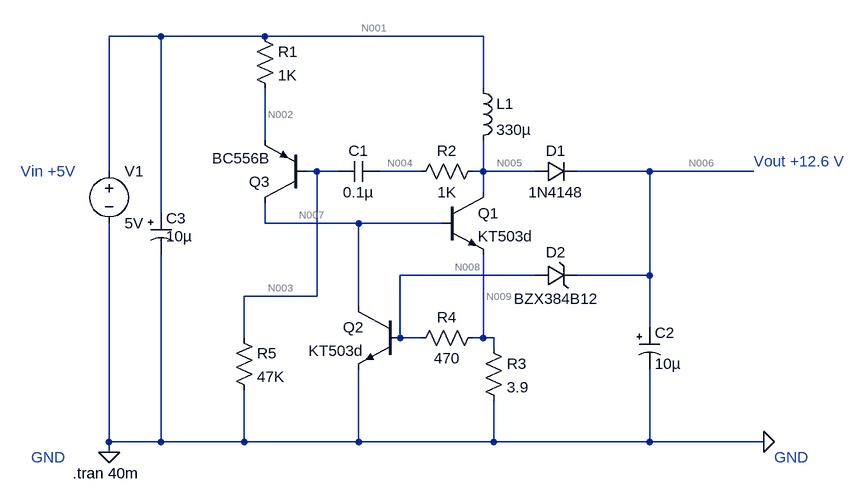
[diagram p0: schematic курсач.asc]
курсач.asc, the LTspice schematic file:
Version 4
SHEET 1 1116 704
WIRE 48 16 -32 16
WIRE 208 16 48 16
WIRE 544 16 208 16
WIRE 544 96 544 16
WIRE 208 176 208 96
WIRE -32 224 -32 16
WIRE 288 224 272 224
WIRE 320 224 288 224
WIRE 448 224 384 224
WIRE 544 224 544 176
WIRE 544 224 528 224
WIRE 624 224 544 224
WIRE 800 224 688 224
WIRE 960 224 800 224
WIRE 544 256 544 224
WIRE 48 288 48 16
WIRE 208 304 208 272
WIRE 352 304 208 304
WIRE 480 304 352 304
WIRE 624 384 416 384
WIRE 800 384 800 224
WIRE 800 384 688 384
WIRE 288 416 288 224
WIRE 288 416 176 416
WIRE 352 432 352 304
WIRE 800 464 800 384
WIRE 176 480 176 416
WIRE 416 480 416 384
WIRE 448 480 416 480
WIRE 544 480 544 352
WIRE 544 480 528 480
WIRE 560 480 544 480
WIRE 560 496 560 480
WIRE -32 640 -32 304
WIRE 48 640 48 352
WIRE 48 640 -32 640
WIRE 176 640 176 560
WIRE 176 640 48 640
WIRE 352 640 352 528
WIRE 352 640 176 640
WIRE 560 640 560 576
WIRE 560 640 352 640
WIRE 800 640 800 528
WIRE 800 640 560 640
WIRE 976 640 800 640
WIRE -32 656 -32 640
FLAG 976 640 0
FLAG -32 656 0
SYMBOL res 192 0 R0
SYMATTR InstName R1
SYMATTR Value 1K
SYMATTR SpiceLine tol=1 pwr=0.1
SYMBOL cap 384 208 R90
WINDOW 0 0 32 VBottom 2
WINDOW 3 32 32 VTop 2
SYMATTR InstName C1
SYMATTR Value 0.1µ
SYMBOL res 544 208 R90
WINDOW 0 0 56 VBottom 2
WINDOW 3 32 56 VTop 2
SYMATTR InstName R2
SYMATTR Value 1K
SYMATTR SpiceLine tol=1 pwr=0.1
SYMBOL ind 528 80 R0
SYMATTR InstName L1
SYMATTR Value 330µ
SYMATTR SpiceLine Ipk=0.06 Rser=16.424 Rpar=31086 Cpar=0 mfg="Coilcraft" pn="0805PS-334"
SYMBOL diode 624 240 R270
WINDOW 0 32 32 VTop 2
WINDOW 3 0 32 VBottom 2
SYMATTR InstName D1
SYMATTR Value 1N4148
SYMBOL polcap 784 464 R0
WINDOW 3 24 56 Left 2
SYMATTR Value 10µ
SYMATTR InstName C2
SYMATTR Description Capacitor
SYMATTR Type cap
SYMATTR SpiceLine V=12.5 Irms=2.12132 Rser=0.06 Lser=0 mfg="KEMET" pn="A700V106M12RATE060" type="Al electrolytic"
SYMBOL res 544 480 R0
SYMATTR InstName R3
SYMATTR Value 3.9
SYMBOL res 544 464 R90
WINDOW 0 0 56 VBottom 2
WINDOW 3 32 56 VTop 2
SYMATTR InstName R4
SYMATTR Value 470
SYMBOL polcap 32 288 R0
WINDOW 3 24 36 Left 2
SYMATTR Value 10µ
SYMATTR InstName C3
SYMATTR Description Capacitor
SYMATTR Type cap
SYMATTR SpiceLine V=12.5 Irms=2.12132 Rser=0.06 Lser=0 mfg="KEMET" pn="A700V106M12RATE060" type="Al electrolytic"
SYMBOL zener 624 400 R270
WINDOW 0 36 32 VTop 2
WINDOW 3 -4 32 VBottom 2
SYMATTR InstName D2
SYMATTR Value BZX384B12
SYMBOL voltage -32 208 R0
WINDOW 123 0 0 Left 0
WINDOW 39 0 0 Left 0
SYMATTR InstName V1
SYMATTR Value 5V
SYMBOL res 160 464 R0
SYMATTR InstName R5
SYMATTR Value 47K
SYMATTR SpiceLine tol=1 pwr=0.1
SYMBOL npn 480 256 R0
SYMATTR InstName Q1
SYMATTR Value KT503d
SYMBOL npn 416 432 M0
SYMATTR InstName Q2
SYMATTR Value KT503d
SYMBOL pnp 272 272 R180
SYMATTR InstName Q3
SYMATTR Value BC556B
TEXT -88 688 Left 2 !.tran 40m
TEXT 960 208 Left 2 ;Vout +12.6 V
TEXT -168 224 Left 2 ;Vin +5V
TEXT -152 664 Left 2 ;GND
TEXT 992 664 Left 2 ;GND

The netlist it stands for:
* курсач.asc
R1 N001 N002 1K tol=1 pwr=0.1
C1 N004 N003 0.1µ
R2 N005 N004 1K tol=1 pwr=0.1
L1 N001 N005 330µ Ipk=0.06 Rser=16.424 Rpar=31086 Cpar=0 mfg="Coilcraft" pn="0805PS-334"
D1 N005 N006 1N4148
C2 N006 0 10µ V=12.5 Irms=2.12132 Rser=0.06 Lser=0 mfg="KEMET" pn="A700V106M12RATE060" type="Al electrolytic"
R3 N009 0 3.9
R4 N009 N008 470
C3 N001 0 10µ V=12.5 Irms=2.12132 Rser=0.06 Lser=0 mfg="KEMET" pn="A700V106M12RATE060" type="Al electrolytic"
D2 N008 N006 BZX384B12
V1 N001 0 5V
R5 N003 0 47K tol=1 pwr=0.1
Q1 N005 N007 N009 0 KT503d
Q2 N007 N008 0 0 KT503d
Q3 N007 N003 N002 0 BC556B
.model D D
.lib standard.dio
.model NPN NPN
.model PNP PNP
.lib standard.bjt
.tran 40m
* Vout +12.6 V
* Vin +5V
* GND
* GND
.backanno
.end

* Results of the author's LTspice run, read from the files saved beside the schematic
* Operating Point, zero values left out:
*   V(n001) = 5 V
*   V(n002) = 1.604 V
*   V(n004) = 2.212 V
*   V(n003) = 941.5 mV
*   V(n005) = 2.212 V
*   V(n006) = 2.212 V
*   V(n009) = 671.6 mV
*   V(n008) = 663.9 mV
*   V(n007) = 1.49 V
*   Ic(Q3) = -3.376 mA
*   Ib(Q3) = -20.03 µA
*   Ie(Q3) = 3.396 mA
*   Ic(Q2) = 961.7 µA
*   Ib(Q2) = 16.49 µA
*   Ie(Q2) = -978.1 µA
*   Ic(Q1) = 169.8 mA
*   Ib(Q1) = 2.415 mA
*   Ie(Q1) = -172.2 mA
*   I(D2) = -1.56 pA
*   I(D1) = 1.561 pA
*   I(L1) = 169.8 mA
*   I(R5) = 20.03 µA
*   I(R4) = 16.49 µA
*   I(R3) = 172.2 mA
*   I(R1) = 3.396 mA
*   I(V1) = -173.2 mA